# Altium schematic sheet Encoders.SchDoc
size B
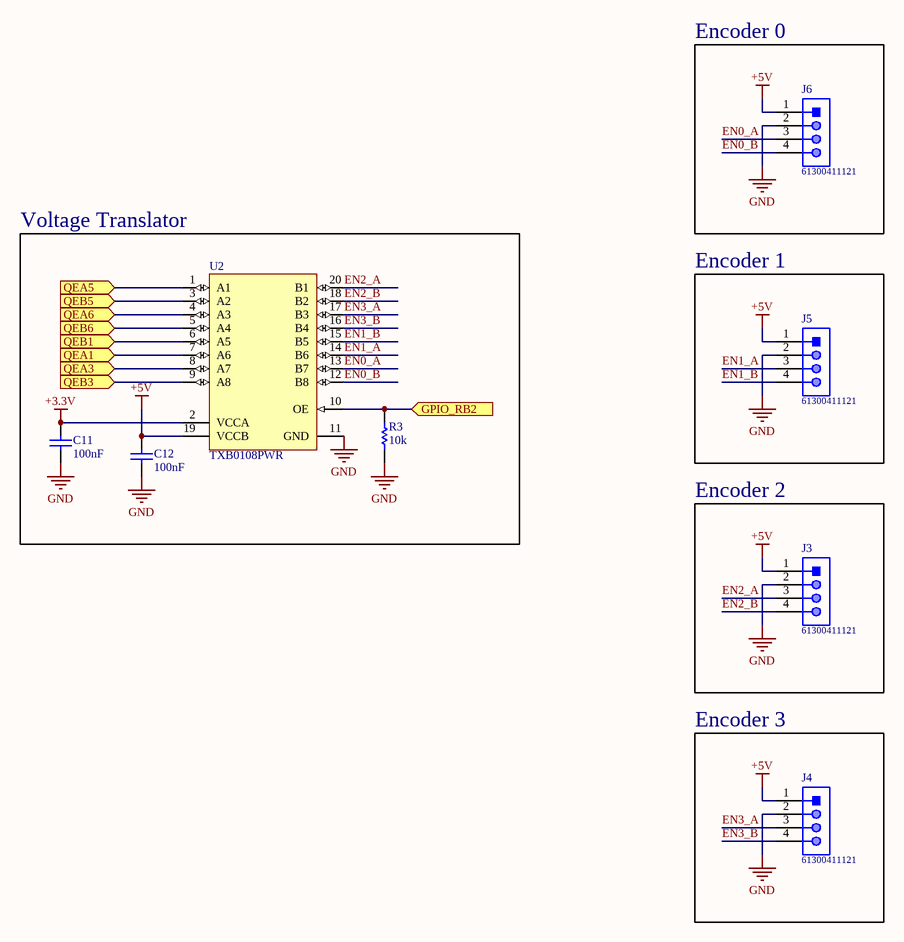
[diagram p0: Encoders.SchDoc]

## Parts
C11  100nF  [0402]
C12  100nF  [0402]
J3  61300411121  [61300411121]
J4  61300411121  [61300411121]
J5  61300411121  [61300411121]
J6  61300411121  [61300411121]
R3  10k  [0402]
U2  TXB0108PWR  [PW0020A_L]

## Blocks framed on the sheet
Encoder 0: J6
Voltage Translator: C11 C12 R3 U2
Encoder 1: J5
Encoder 2: J3
Encoder 3: J4

## Ports
GPIO_RB2 (in), QEA1 (in), QEA3 (in), QEA5 (in), QEA6 (in), QEB1 (in), QEB3 (in), QEB5 (in), QEB6 (in)

## Nets
+3.3V: C11.2 U2.2(VCCA)
+5V: C12.2 J3.1 J4.1 J5.1 J6.1 U2.19(VCCB)
GND: C11.1 C12.1 J3.2 J4.2 J5.2 J6.2 R3.1 U2.11(GND)
EN0_A: J6.3 U2.13(B7)
EN0_B: J6.4 U2.12(B8)
EN1_A: J5.3 U2.14(B6)
EN1_B: J5.4 U2.15(B5)
EN2_A: J3.3 U2.20(B1)
EN2_B: J3.4 U2.18(B2)
EN3_A: J4.3 U2.17(B3)
EN3_B: J4.4 U2.16(B4)
GPIO_RB2: R3.2 U2.10(OE) ; port GPIO_RB2
QEA1: U2.7(A6) ; port QEA1
QEA3: U2.8(A7) ; port QEA3
QEA5: U2.1(A1) ; port QEA5
QEA6: U2.4(A3) ; port QEA6
QEB1: U2.6(A5) ; port QEB1
QEB3: U2.9(A8) ; port QEB3
QEB5: U2.3(A2) ; port QEB5
QEB6: U2.5(A4) ; port QEB6

## Library data of the parts
C11 C12 = C1005X7R1C104K050BC: TDK - C1005X7R1C104K050BC. - CERAMIC CAPACITOR, 0.1UF, 16V, X7R, 10%, 0402, FULL REEL; Part Name: C1005X7R1C104K050BC; Supplier 1: Digi-Key; Supplier Part Number 1: 445-4952-1-ND; Manufacturer: TDK; Manufacturer Part Number: C1005X7R1C104K050BC; RoHS: Yes; Category: Ceramic Capacitors; Stock 1: 2957810; Pricing 1: 1=0.10000, 10=0.07500, 100=0.03350, 500=0.02390, 1000=0.01879, 2500=0.01708, 5000=0.01571 (USD); Mount: Surface Mount; Case/Package: 0402; Min Operating Temperature: -55°C; Max Operating Temperature: 125°C; Termination: SMD/SMT; Voltage: 16V; Tolerance: 10%; Capacitance: 100nF; Packaging: Tape and Reel; Voltage Rating: 16V; Package Quantity: 1; Voltage Rating (DC): 16V; Length: 1mm; Height: 0.5mm; Radiation Hardening: No; REACH SVHC: Unknown; Number of Pins: 2; Weight: 2.3E-05oz; Case Code (Metric): 1005; Case Code (Imperial): 0402; Dielectric Material: Ceramic; Dielectric: X7R; Composition: Ceramic; Depth: 0.5mm; Thickness: 0.022inch; Width: 0.02inch; Lead Free: Lead Free
J3-J6 = CMP-1502-01064-1: THT Vertical Pin Header WR-PHD, Pitch 2.54 mm, Single Row, 4 pins; Manufacturer: Wurth Elektronik; Withstanding Voltage: 500VAC; Rated Current: 3A; Working Voltage: 250VAC; Pin Number: 4; Gender: Male; Contact Resistance: 20mOhm; Pitch: 2.54mm; Manufacturer URL: http://www.we-online.de; Operating Temperature: -40to105degC; Packaging: Bag; Mounting Technology: THT; Package Reference: 61300411121; Datasheet URL: https://katalog.we-online.de/em/datasheet/6130xx11121.pdf; Publisher: WurthElektronik; Part Number: 61300411121; Row Number: Single; Orientation: Vertical
R3 = CRCW040210K0FKEDC: D10/CRCW0402-C 100 10K 1% ET7; Manufacturer: Vishay; Power Rating: 62.5mW; Temperature Coefficient: 100ppm/°C; Part Name: CRCW040210K0FKEDC; Supplier 1: Digi-Key; Supplier Part Number 1: 541-3959-6-ND; Manufacturer Part Number: CRCW040210K0FKEDC; RoHS: Yes; Category: Resistors; Stock 1: 3541307; Pricing 1: 1=0.10000, 10=0.03200, 100=0.01300, 1000=0.00583, 2500=0.00506, 5000=0.00418 (USD); Case/Package: Molded; Contact Plating: Tin; Min Operating Temperature: -55°C; Max Operating Temperature: 155°C; Tolerance: 1%; Termination: Wraparound; Resistance: 10k; Composition: Thick Film; Length: 1mm; Lead Free: Lead Free
U2 = CMP-2000-07337-1: TXB0108 8-Bit Bidirectional Voltage-Level Translator with Auto-Direction Sensing and / +/- 15-kV ESD Protection, 1.2 to 3.6 V, -40 to 85 degC, 20-Pin TSSOP (PW), Green (RoHS & no Sb/Br), Tape and Reel; Manufacturer: Texas Instruments; Propagation Delay (Max): 4ns; Logic Function: Translator,Bidirectional; Input Type: Logic; Package Version: 4040064-5/G, 02/2011; Voltage - Supply: 1.2V~3.6V,1.65V~5.5V; Data Rate: 100Mbps; Other Names: 296-21527-6; Number of Channels: 8; Differential - Input: Output:No/No; Number of Outputs/Channel: 1; Product Training Modules: VoltageLevelTranslation; Dynamic Catalog: TXBSeries; Package Reference: PW20; Package Description: 20-Pin Small Outline Package Integrated Circuit, Body 6.5 x 4.4 mm, Pitch 0.65 mm; Category: IntegratedCircuits(ICs); Datasheet URL: http://www.ti.com/general/docs/lit/getliterature.tsp?genericPartNumber=TXB0108&fileType=pdf; Package / Case: 20-TSSOP(0.173",4.40mmWidth); Family: Logic-Translators; Standard Package: 1; Series: -; Manufacturer URL: http://www.ti.com/; Number of Bits: 8; Package URL: http://www.ti.com/litv/pdf/mpds362; Output Type: Logic; Datasheet Version: Rev. F, 12/2014; Packaging: Digi-Reel®; Operating Temperature: -40°C~85°C; Supplier Device Package: 20-TSSOP; Mounting Technology: SurfaceMount